# EAGLE design proyecto (EAGLE 8.2.0)
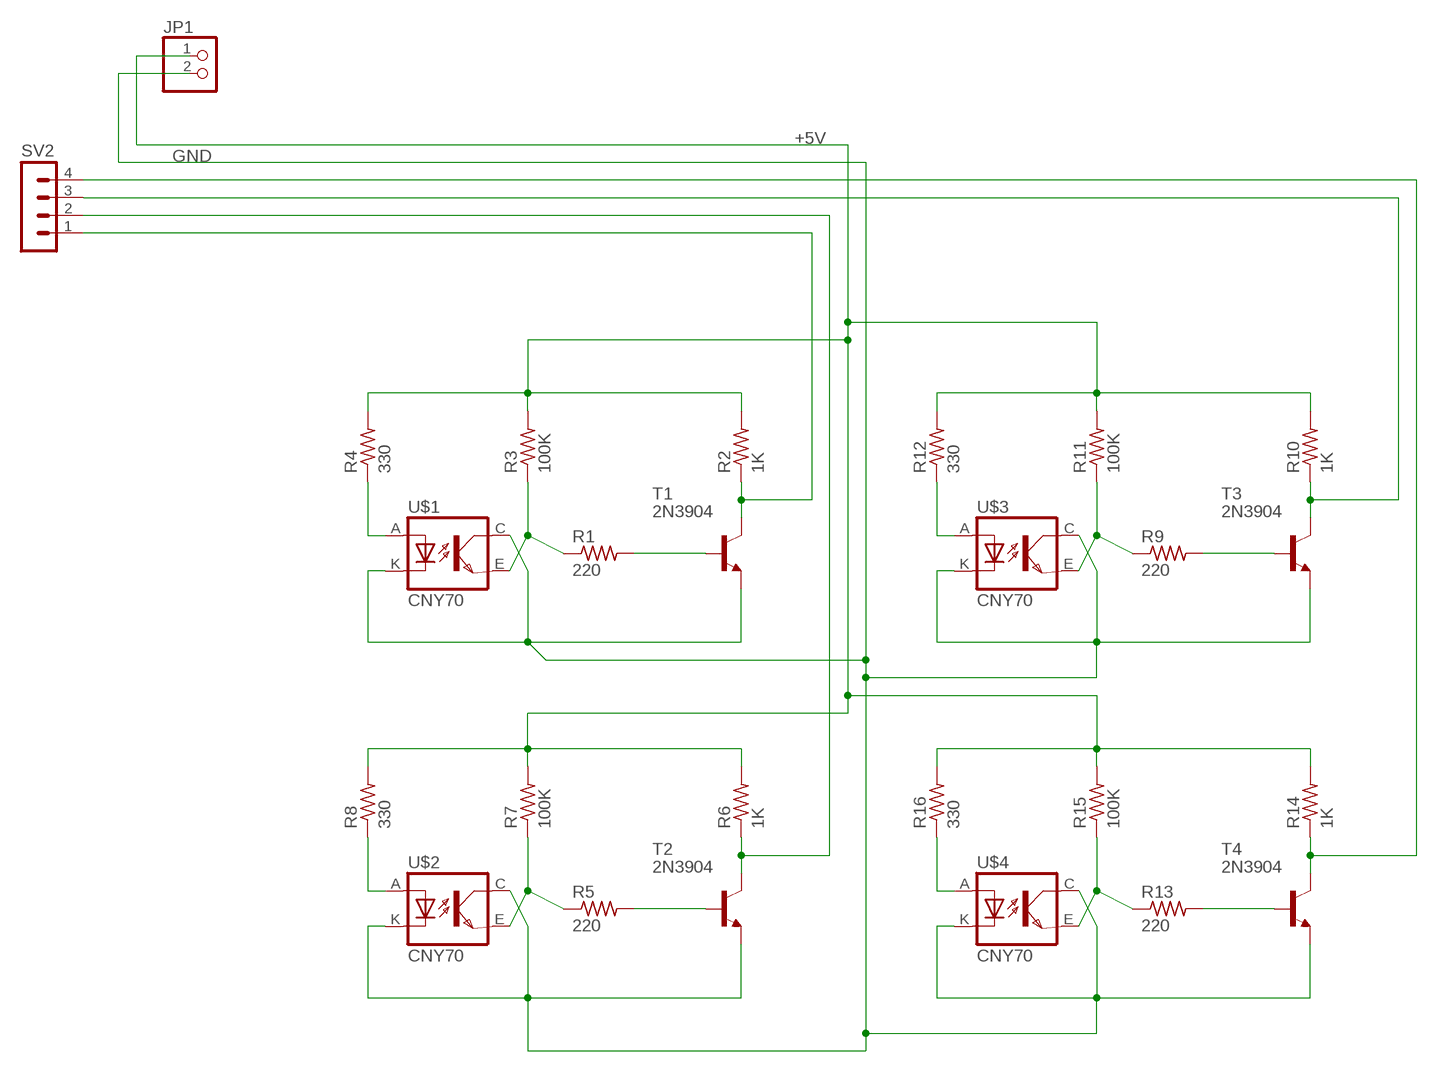
[diagram p0: schematic, sheet 1]

## Parts
JP1  PINHD-1X2  [1X02]
R1  220  R-US_0207/10  [0207/10]
R2  1K  R-US_0207/10  [0207/10]
R3  100K  R-US_0207/10  [0207/10]
R4  330  R-US_0207/10  [0207/10]
R5  220  R-US_0207/10  [0207/10]
R6  1K  R-US_0207/10  [0207/10]
R7  100K  R-US_0207/10  [0207/10]
R8  330  R-US_0207/10  [0207/10]
R9  220  R-US_0207/10  [0207/10]
R10  1K  R-US_0207/10  [0207/10]
R11  100K  R-US_0207/10  [0207/10]
R12  330  R-US_0207/10  [0207/10]
R13  220  R-US_0207/10  [0207/10]
R14  1K  R-US_0207/10  [0207/10]
R15  100K  R-US_0207/10  [0207/10]
R16  330  R-US_0207/10  [0207/10]
SV2  MA04-1  [MA04-1]
T1  2N3904  [TO92]
T2  2N3904  [TO92]
T3  2N3904  [TO92]
T4  2N3904  [TO92]
U$1  CNY70  [4]
U$2  CNY70  [4]
U$3  CNY70  [4]
U$4  CNY70  [4]

## Nets
+5V: JP1.1 R2.2 R3.2 R4.2 R6.2 R7.2 R8.2 R10.2 R11.2 R12.2 R14.2 R15.2 R16.2
GND: JP1.2 T1.3(E) T2.3(E) T3.3(E) T4.3(E) U$1.C(COL) U$1.K(C) U$2.C(COL) U$2.K(C) U$3.C(COL) U$3.K(C) U$4.C(COL) U$4.K(C)
N$1: R1.1 R3.1 U$1.E(EMI)
N$2: R4.1 U$1.A
N$3: R5.1 R7.1 U$2.E(EMI)
N$4: R8.1 U$2.A
N$5: R1.2 T1.2(B)
N$6: R5.2 T2.2(B)
N$7: R9.1 R11.1 U$3.E(EMI)
N$8: R12.1 U$3.A
N$9: R9.2 T3.2(B)
N$10: R13.1 R15.1 U$4.E(EMI)
N$11: R16.1 U$4.A
N$12: R13.2 T4.2(B)
S1: R2.1 SV2.1 T1.1(C)
S2: R6.1 SV2.2 T2.1(C)
S3: R10.1 SV2.3 T3.1(C)
S4: R14.1 SV2.4 T4.1(C)

## Library data of the parts
JP1 = pinhead:PINHD-1X2: PIN HEADER
R1-R16 = resistor:R-US_: RESISTOR, American symbol
SV2 = con-lstb:MA04-1: PIN HEADER; OC_FARNELL: unknown; OC_NEWARK: unknown
T1-T4 = transistor:2N3904: NPN TRANSISTOR
U$1-U$4 = cny70:CNY70

## Board
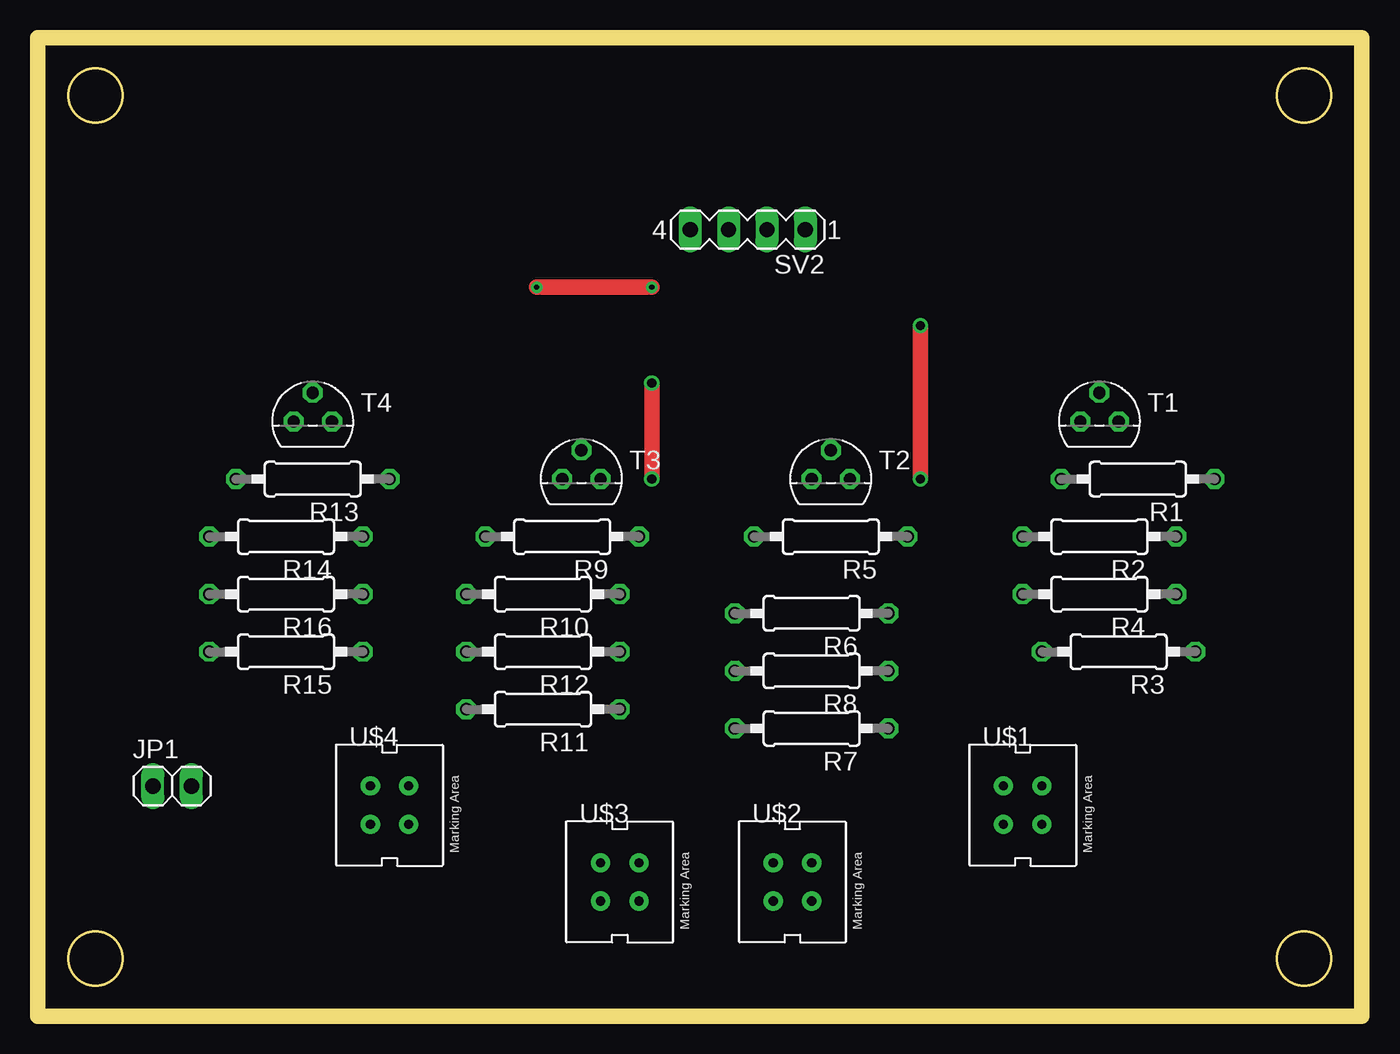
[diagram p1: board, top side]
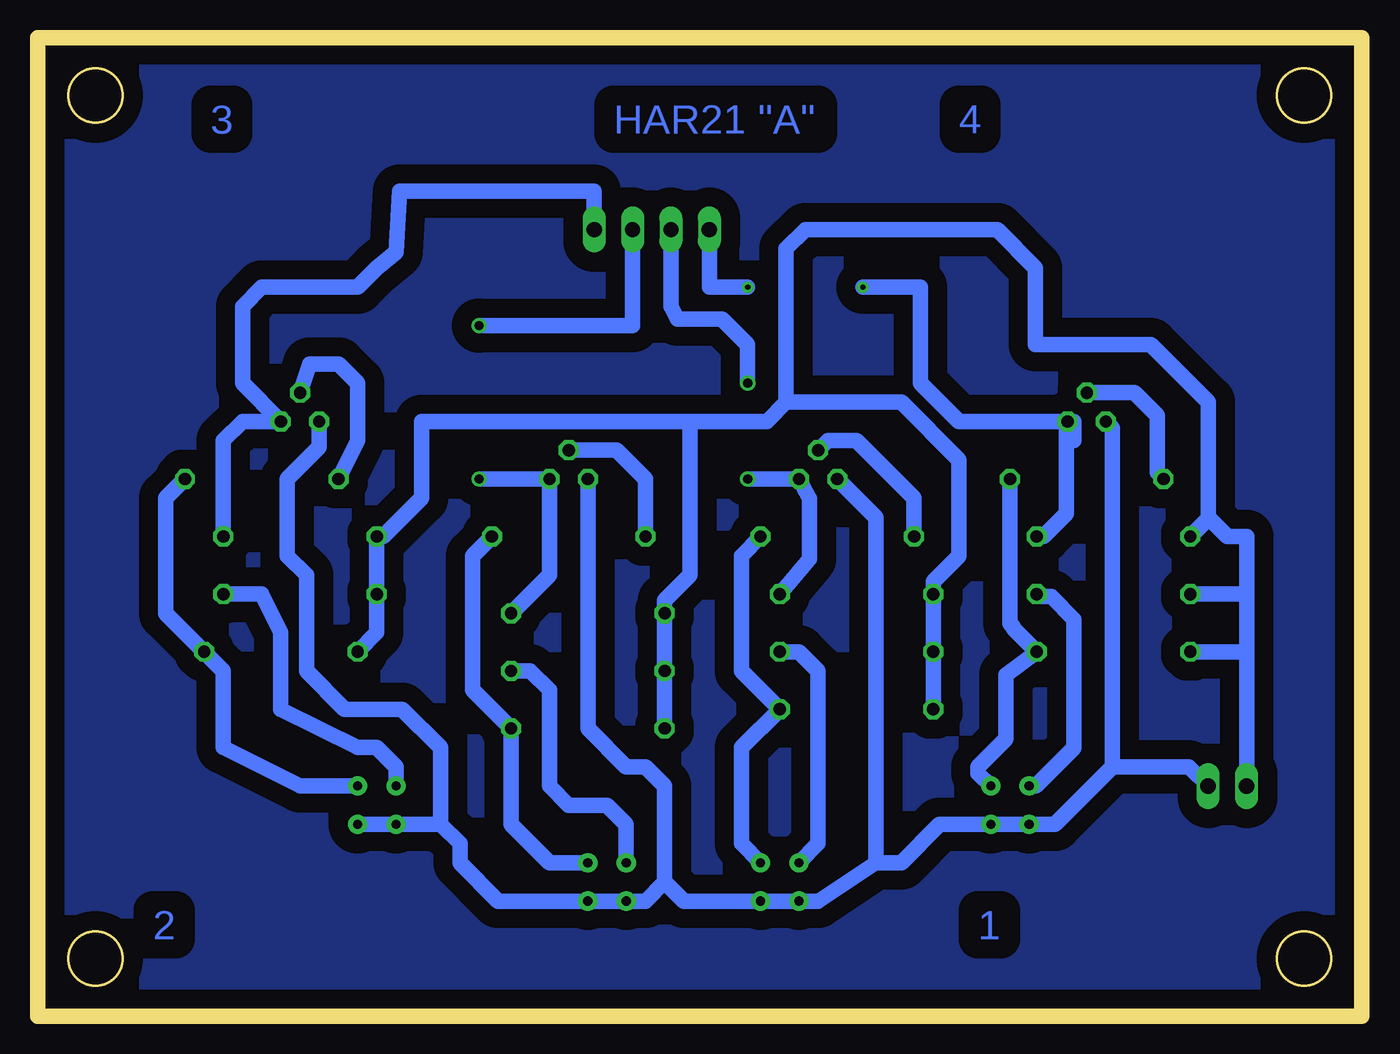
[diagram p2: board, bottom side, seen from below]

Size 87.63 x 64.77 mm. Coordinates in mm from the lower left corner, seen from the top.
Outline: 0,0 0,64.77 87.63,64.77 87.63,0 0,0
Outline: circle at 3.81,60.96 radius 1.8
Outline: circle at 3.81,3.81 radius 1.8
Outline: circle at 83.82,60.96 radius 1.8
Outline: circle at 83.82,3.81 radius 1.8
Copper layers (1*16): Top 0.035mm / dielectric 1.5mm / Bottom 0.035mm
Design rules "default": minimum track width 10mil, minimum drill 24mil, track to track 8mil, track to pad 8mil, pad to pad 8mil, via to via 8mil, smd to smd 8mil, copper to edge 40mil, drill to drill 8mil, minimum pad ring 10mil, minimum via ring 8mil, stop-mask expansion 4mil, vias tented up to drill 0mil, thermal gap 10mil

### Footprints (pad centres in the part's own frame; a part is rotated, then mirrored left to right if it is on the bottom)
1X02 = drill 1.016 long: 1 -1.27,0; 2 1.27,0
0207/10 = drill 0.813 octagon: 1 -5.08,0; 2 5.08,0
MA04-1 = drill 1.016 long: 1 -3.81,0; 2 -1.27,0; 3 1.27,0; 4 3.81,0
TO92 = drill 0.813 octagon: 1 1.27,0; 2 0,1.905; 3 -1.27,0
4 = drill 0.61 pad 1.27: A -1.27,1.27; C 1.27,-1.27; E 1.27,1.27; K -1.27,-1.27

### Placement (x,y rotation side)
JP1  8.89,15.24 0 top
R1  72.81,35.56 180 top
R2  70.27,31.75 180 top
R3  71.54,24.13 180 top
R4  70.27,27.94 180 top
R5  52.49,31.75 180 top
R6  51.22,26.67 180 top
R7  51.22,19.05 180 top
R8  51.22,22.86 180 top
R9  34.71,31.75 180 top
R10  33.44,27.94 180 top
R11  33.44,20.32 180 top
R12  33.44,24.13 180 top
R13  18.2,35.56 180 top
R14  16.43,31.75 180 top
R15  16.43,24.13 180 top
R16  16.43,27.94 180 top
SV2  46.99,52.07 180 top
T1  70.27,39.37 0 top
T2  52.49,35.56 0 top
T3  35.98,35.56 0 top
T4  18.2,39.37 0 top
U$1  65.19,13.97 0 top
U$2  49.95,8.89 0 top
U$3  38.52,8.89 0 top
U$4  23.28,13.97 0 top

### Tracks (layer width: path | path; a pad name or v marks a point on that pad's centre or on a via)
+5V
  Bottom 1.016: R11.2 R12.2 R10.2 28.36,28.79 26.67,30.48 26.67,36.83 30.48,40.64 38.1,40.64 | R7.2 R8.2 R6.2 46.14,27.52 44.45,29.21 44.45,39.37 | R3.2 65.19,25.4 R4.2 R2.2 64.77,31.75 62.23,34.29 62.23,39.37 44.45,39.37 | 44.45,39.37 39.37,39.37 38.1,40.64 | 38.1,40.64 38.1,50.8 36.83,52.07 24.13,52.07 21.59,49.53 21.59,44.45 13.97,44.45 10.16,40.64 10.16,33.02 | R14.2 10.16,32.94 10.16,33.02 | R15.2 7.62,24.13 | 7.62,24.13 JP1.1 | 7.62,24.13 7.62,27.94 | 7.62,27.94 R16.2 | 7.62,27.94 7.62,31.75 8.89,31.75 10.16,33.02
GND
  Bottom 1.016: T2.3 51.22,19.05 48.68,16.51 47.41,16.51 46.14,15.24 46.14,8.89 | 46.14,8.89 47.41,7.62 U$2.K U$2.C 57.15,7.62 59.69,10.16 59.69,11.43 60.96,12.7 | 32.17,10.16 35.98,7.62 U$3.K U$3.C 44.87,7.62 46.14,8.89 | 32.17,10.16 32.17,33.02 T3.3 | U$1.C U$1.K 60.96,12.7 | 32.17,10.16 30.48,10.16 27.94,12.7 U$4.C U$4.K 20.32,12.7 16.51,16.51 | 16.51,16.51 16.51,38.95 T4.3 | 16.51,16.51 11.43,16.51 JP1.2 | T1.3 69,37.68 71.12,35.56 71.12,30.48 69.85,29.21 69.85,22.86 67.31,20.32 63.5,20.32 60.96,17.78 60.96,12.7
N$1
  Bottom 1.016: R1.1 79.16,34.29 79.16,26.67 R3.1 75.35,22.86 75.35,17.78 70.27,15.24 U$1.E
N$2
  Bottom 1.016: U$1.A 63.92,16.51 65.19,17.78 66.46,17.78 71.54,20.32 71.54,25.4 72.81,27.94 R4.1
N$3
  Bottom 1.016: R5.1 58.84,30.48 58.84,21.59 R7.1 56.3,12.7 53.76,10.16 U$2.E
N$4
  Bottom 1.016: U$2.A 48.68,12.7 49.95,13.97 52.49,13.97 53.76,15.24 53.76,21.59 55.03,22.86 R8.1
N$5
  Bottom 1.016: T1.2 69.64,43.18 67.73,43.18 66.46,41.91 66.46,38.1 R1.2
N$6
  Bottom 1.016: T2.2 49.31,37.47 47.41,35.56 R5.2
N$7
  Bottom 1.016: R9.1 41.06,30.48 41.06,22.86 R11.1 41.06,17.78 41.06,11.43 U$3.E
N$8
  Bottom 1.016: R12.1 37.25,24.13 35.98,22.86 35.98,11.43 U$3.A
N$9
  Bottom 1.016: R9.2 29.63,34.29 33.44,38.1 35.34,38.1 T3.2
N$10
  Bottom 1.016: R13.1 23.28,26.01 23.04,25.77 23.04,25.66 R15.1 23.54,22.6 23.54,18.37 25.4,16.51 25.4,16.09 U$4.E
N$11
  Bottom 1.016: U$4.A 21.57,15.24 19.04,17.77 19.04,26.27 20.54,27.77 21.34,27.77 R16.1
N$12
  Bottom 1.016: T4.2 15.04,41.27 13.54,39.77 13.54,35.98 R13.2
N$14
  pour Bottom (isolate 1.27): 0,0 0,64.77 87.63,64.77 87.63,0
S1
  Bottom 1.016: R2.1 75.35,38.1 74.08,39.37 T1.1 74.08,41.91 74.08,46.99 72.81,48.26 66.46,48.26 65.19,49.53 63.92,50.57 63.69,54.61 50.8,54.61 SV2.1
S2  (via drill 0.6)
  Top 1.016: v58.42,35.56 v58.42,45.72
  Bottom 1.016: R6.1 53.76,29.21 T2.1 v58.42,35.56 | SV2.2 48.26,45.72 v58.42,45.72
S3  (via drill 0.6)
  Top 1.016: v40.64,35.56 v40.64,41.91
  Bottom 1.016: R10.1 36.54,30.27 36.54,34.27 T3.1 v40.64,35.56 | v40.64,41.91 40.64,44.45 42.33,46.14 45.3,46.14 45.72,46.99 SV2.3
S4  (via drill 0.35)
  Top 1.016: v40.64,48.26 v33.02,48.26
  Bottom 1.016: R14.1 21.06,31.75 19.54,33.27 19.54,38.1 | 19.54,38.1 19.54,38.77 | 19.54,38.1 19.05,38.1 19.05,39.37 T4.1 26.67,39.37 29.21,41.91 29.21,48.26 v33.02,48.26 | SV2.4 43.18,48.26 v40.64,48.26

### Text on the board
Bottom: 4 | HAR21 "A" | 3 | 1 | 2